# Altium schematic sheet Mosaic-G5.SchDoc
size 420 x 297 mm; CompanyName: Septentrio; Organization: Designed by ANavS; Address1: Septentrio; Address2: Interleuvenlaan 15i; Address3: 3001, Leuven; Address4: Belgium; SheetNumber: 3; SheetTotal: 3
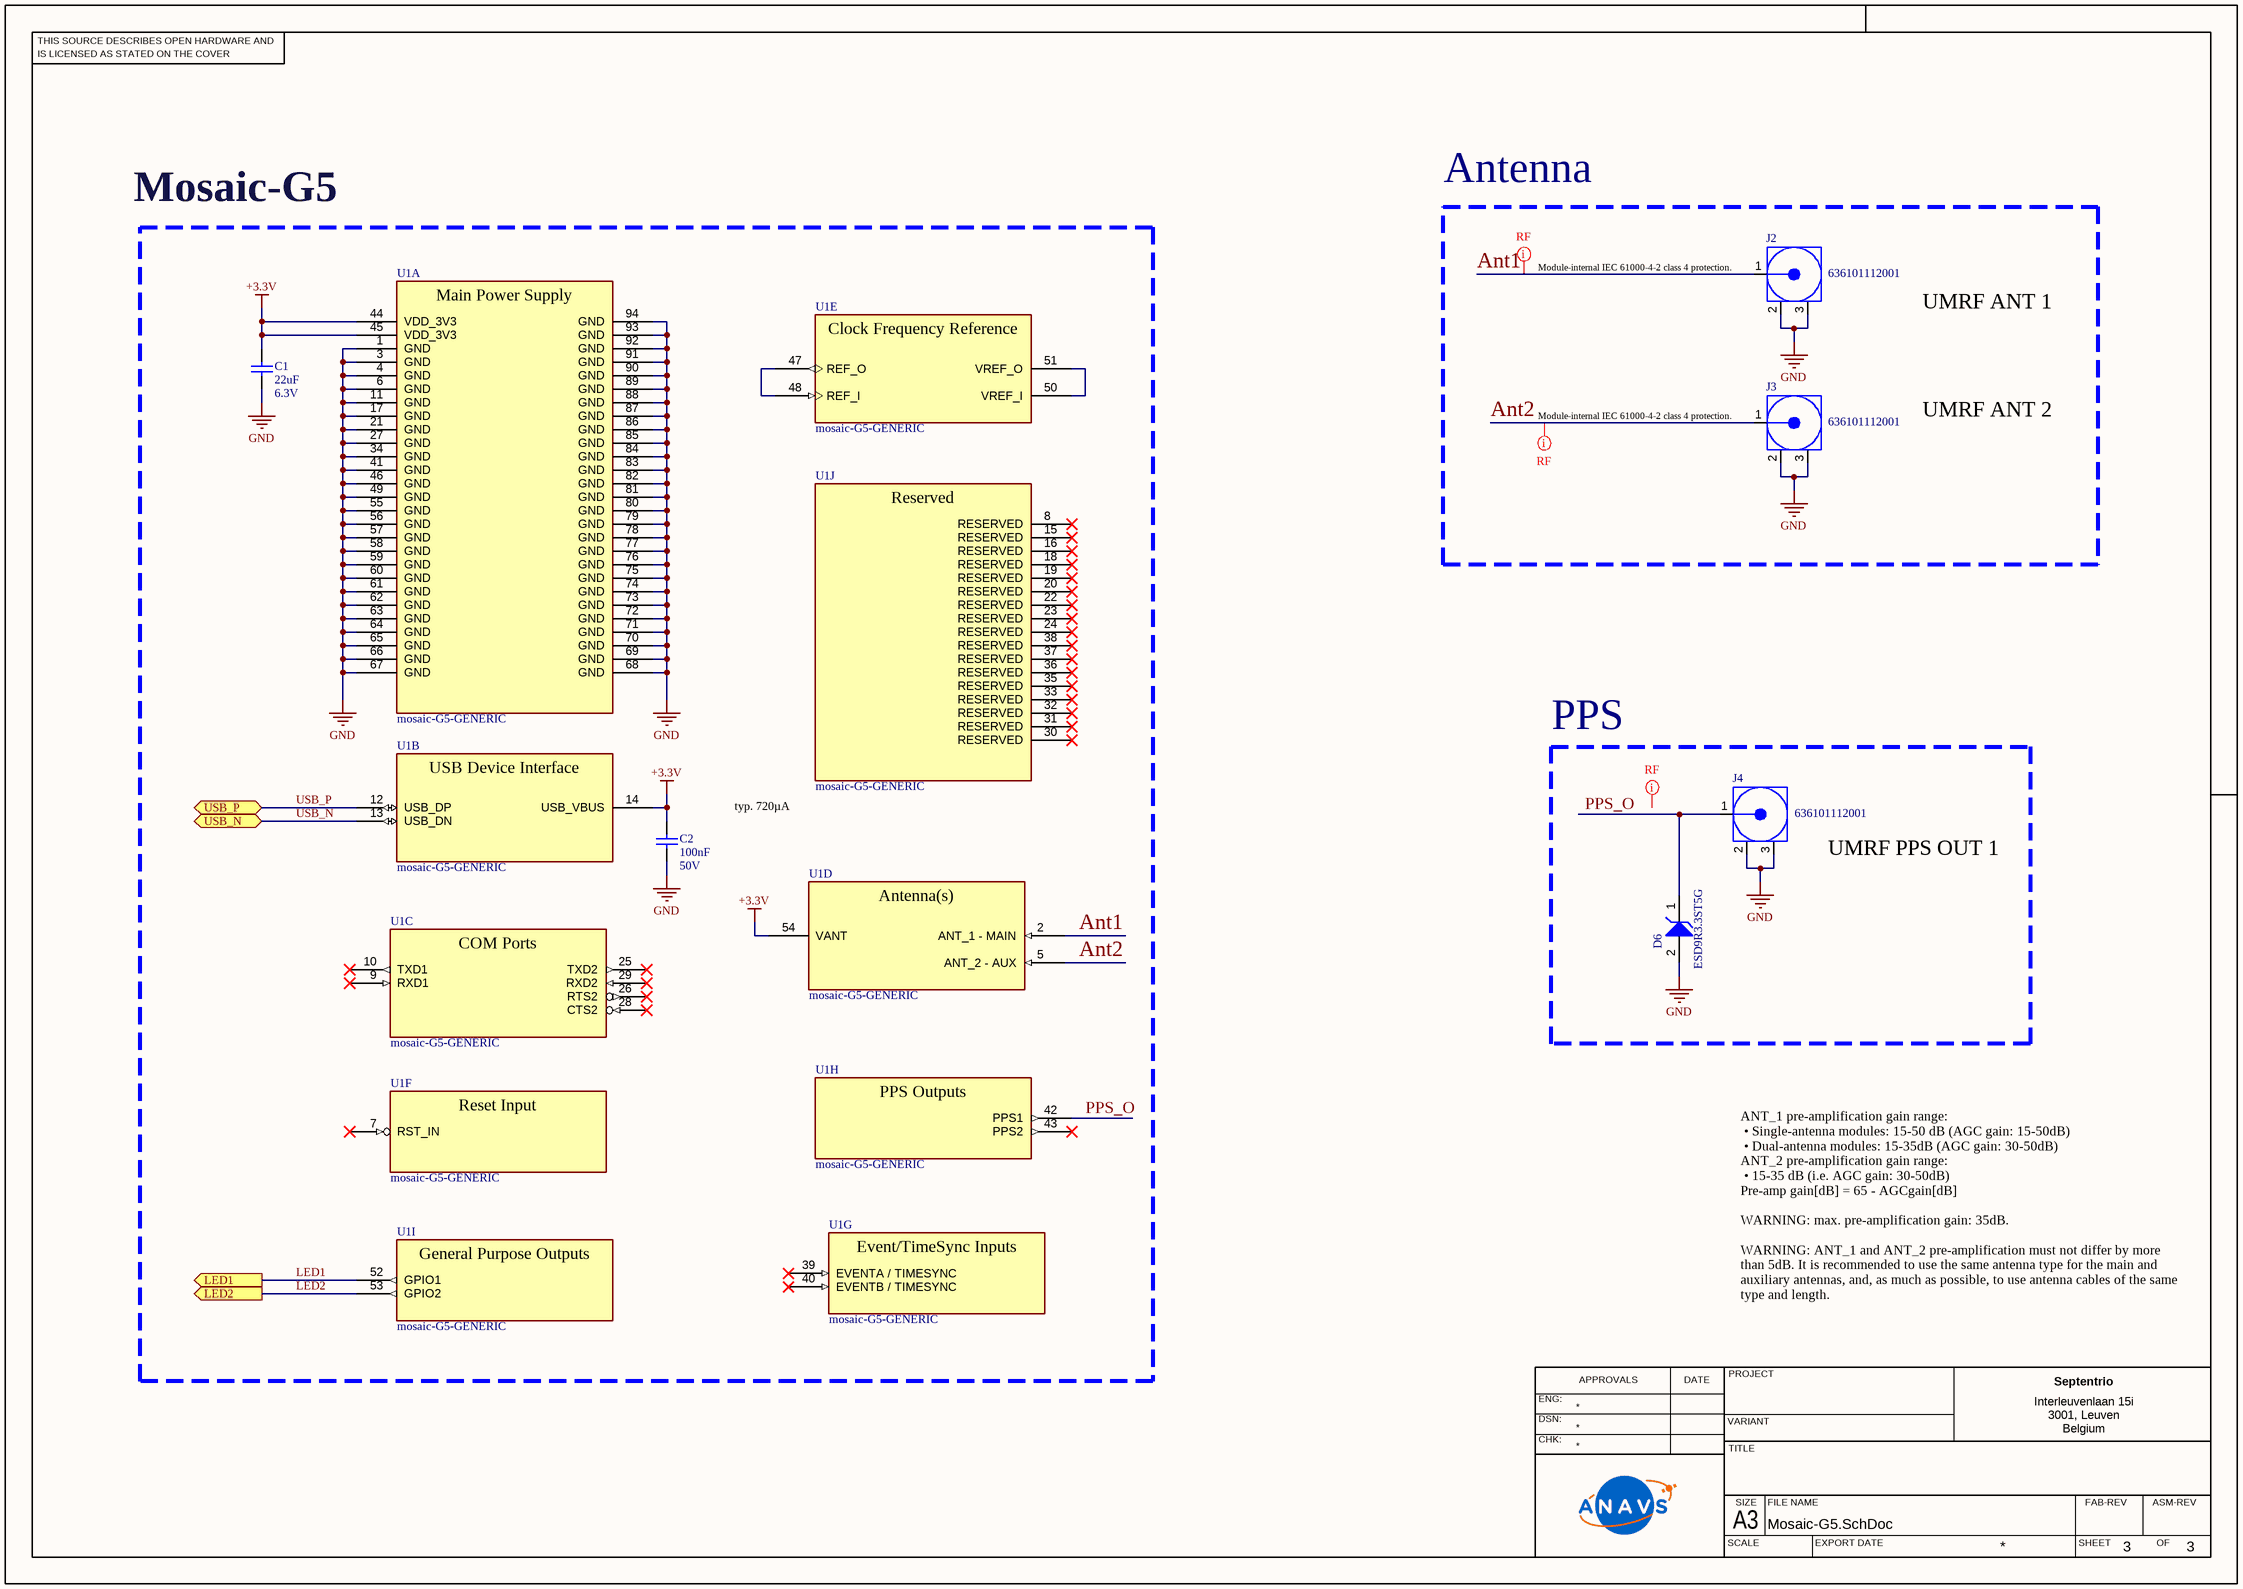
[diagram p0: Mosaic-G5.SchDoc]

## Parts
C1  value 22uF  Voltage: 6.3V  [CAPC1608X100X20ML10]  (hidden comment: C1608X5R0J226M080AC)
C2  Capacitance: 100nF  Voltage: 50V  [CAP0402C]  (hidden comment: GCM155R71H104KE02D)
D6  ESD9R3.3ST5G  [ONSC-SOD-923-2-514AB-01_V]
J2  636101112001  [63610111x001]
J3  636101112001  [63610111x001]
J4  636101112001  [63610111x001]
U1  mosaic-G5-GENERIC  [mosaic-G5-GENERIC-Footprint]  (parts A,B,C,D,E,F,G,H,I,J of 10)

## Blocks framed on the sheet
Antenna: J2 J3
typ. 720µA: C1 C2 U1
PPS: D6 J4

## Ports
LED1 (out), LED2 (out), USB_N (bidir), USB_P (bidir)

## Nets
+3.3V: C1.2 C2.2 U1.14(USB_VBUS) U1.44(VDD_3V3) U1.45(VDD_3V3) U1.54(VANT)
GND: C1.1 C2.1 D6.2(A) J2.2(GND) J2.3(GND) J3.2(GND) J3.3(GND) J4.2(GND) J4.3(GND) U1.1(GND) U1.3(GND) U1.4(GND) U1.6(GND) U1.11(GND) U1.17(GND) U1.21(GND) U1.27(GND) U1.34(GND) U1.41(GND) U1.46(GND) U1.49(GND) U1.55(GND) U1.56(GND) U1.57(GND) U1.58(GND) U1.59(GND) U1.60(GND) U1.61(GND) U1.62(GND) U1.63(GND) U1.64(GND) U1.65(GND) U1.66(GND) U1.67(GND) U1.68(GND) U1.69(GND) U1.70(GND) U1.71(GND) U1.72(GND) U1.73(GND) U1.74(GND) U1.75(GND) U1.76(GND) U1.77(GND) U1.78(GND) U1.79(GND) U1.80(GND) U1.81(GND) U1.82(GND) U1.83(GND) U1.84(GND) U1.85(GND) U1.86(GND) U1.87(GND) U1.88(GND) U1.89(GND) U1.90(GND) U1.91(GND) U1.92(GND) U1.93(GND) U1.94(GND)
Ant1: J2.1(Signal) U1.2(ANT_1_-_MAIN)
Ant2: J3.1(Signal) U1.5(ANT_2_-_AUX)
LED1: U1.52(GPIO1) ; port LED1
LED2: U1.53(GPIO2) ; port LED2
PPS_O: D6.1(K) J4.1(Signal) U1.42(PPS1)
USB_N: U1.13(USB_DN) ; port USB_N
USB_P: U1.12(USB_DP) ; port USB_P
NetU1_47: U1.47(REF_O) U1.48(REF_I)
NetU1_50: U1.50(VREF_I) U1.51(VREF_O)

Not connected (* = marked no-connect by the designer): U1 7(RST_IN)* 8(RESERVED)* 9(RXD1)* 10(TXD1)* 15(RESERVED)* 16(RESERVED)* 18(RESERVED)* 19(RESERVED)* 20(RESERVED)* 22(RESERVED)* 23(RESERVED)* 24(RESERVED)* 25(TXD2)* 26(RTS2)* 28(CTS2)* 29(RXD2)* 30(RESERVED)* 31(RESERVED)* 32(RESERVED)* 33(RESERVED)* 35(RESERVED)* 36(RESERVED)* 37(RESERVED)* 38(RESERVED)* 39(EVENTA_/_TIMESYNC)* 40(EVENTB_/_TIMESYNC)* 43(PPS2)*

## Layout directives
net class RF: (no net found under the mark), Ant1, Ant2

## Notes on the sheet
- Mosaic-G5
- (near J2) Module-internal IEC 61000-4-2 class 4 protection.
- UMRF ANT 1
- (near J3) Module-internal IEC 61000-4-2 class 4 protection.
- UMRF ANT 2
- UMRF PPS OUT 1
- ANT_1 pre-amplification gain range:
  • Single-antenna modules: 15-50 dB (AGC gain: 15-50dB)
  • Dual-antenna modules: 15-35dB (AGC gain: 30-50dB)
  ANT_2 pre-amplification gain range:
  • 15-35 dB (i.e. AGC gain: 30-50dB)
  Pre-amp gain[dB] = 65 - AGCgain[dB]
  WARNING: max. pre-amplification gain: 35dB.
  WARNING: ANT_1 and ANT_2 pre-amplification must not differ by more than 5dB. It is recommended to use the same antenna type for the main and auxiliary antennas, and, as much as possible, to use antenna cables of the same type and length.
- THIS SOURCE DESCRIBES OPEN HARDWARE AND
- IS LICENSED AS STATED ON THE COVER
- ENG:
- APPROVALS
- DATE
- PROJECT
- DSN:
- CHK:
- VARIANT
- TITLE
- SCALE
- A3
- SIZE
- FILE NAME
- EXPORT DATE
- SHEET
- FAB-REV
- ASM-REV
- OF
- (in symbol CMP-00025-00009-1, part A) Main Power Supply
- (in symbol CMP-00025-00009-1, part B) USB Device Interface
- (in symbol CMP-00025-00009-1, part C) COM Ports
- (in symbol CMP-00025-00009-1, part D) Antenna(s)
- (in symbol CMP-00025-00009-1, part E) Clock Frequency Reference
- (in symbol CMP-00025-00009-1, part F) Reset Input
- (in symbol CMP-00025-00009-1, part G) Event/TimeSync Inputs
- (in symbol CMP-00025-00009-1, part H) PPS Outputs
- (in symbol CMP-00025-00009-1, part I) General Purpose Outputs
- (in symbol CMP-00025-00009-1, part J) Reserved

## Library data of the parts
C1 = CMP-001-00146-1: MLCC, 22 uF, 0603, 6.3 V, 20%, X5R; Dielectric Material: Ceramic; Case Code (Metric): 1608; Max Operating Temperature: 85°C; RoHS Compliant: Yes; Mounting Technology: Surface Mount; Width: 0.031inch; Lead Free: Lead Free; Length: 1.6mm; Height: 0.8mm; Case Code (Imperial): 0603; Series: C; Depth: 0.8mm; Weight: 7.1E-05oz; Package Quantity: 1; Voltage Rating: 6.3V; Termination: SMD/SMT; Packaging: Tape and Reel; Voltage Rating (DC): 6.3V; Case/Package: 0603; Thickness: 0.039inch; Reach SVHC Compliant: Unknown; Dielectric: X5R; Min Operating Temperature: -55°C; Tolerance: 20%
C2 = CMP-001-00114-5: MLCC, 100 nF, 0402, 50 V, 10%, X7R; Weight: 0.000212oz; Case/Package: 0402; RoHS Compliant: Yes; Ratings: AEC-Q200; Max Operating Temperature: 125°C; Voltage Rating: 50V; Case Code (Metric): 1005; Width: 0.02inch; Length: 0.039inch; Height: 0.5mm; Series: GCM; Reach SVHC Compliant: Yes; Case Code (Imperial): 0402; Dielectric: X7R; Packaging: Tape and Reel; Thickness: 0.022inch; Min Operating Temperature: -55°C; Lead Free: Lead Free; Package Quantity: 10000; Tolerance: 10%; Mount: Surface Mount; Voltage Rating (DC): 50V; Termination: SMD/SMT
D6 = CMP-004-00061-1: ESD9R3.3S Series 4.8 V 0.5 pF Uni-Directional ESD Protection Diode - SOD-923; Breakdown Voltage: 4.8V; Clamping Voltage-Max: 7.8V; Number of Unidirectional Channels: 1; Polarity: Unidirectional; Operating Supply Voltage: 3.3V; Value: 0.9pF; Peak Pulse Current: 1A; ESD Protection: Yes; Max Reverse Leakage Current: 1nA; Max Power Dissipation: 150mW; Power Line Protection: No; Test Current: 1mA; Diode Type: ZENER; Pins: 2; Reach SVHC Compliant: No; Min Operating Temperature: -55°C; Depth: 0.6mm; Height: 0.4mm; Lead Free: Lead Free; Radiation Hardening: No; Number of Elements: 1; Case/Package: SOD-923-2; Number of Channels: 1; Min Breakdown Voltage: 4.8V; Halogen Free: Halogen Free; Width: 0.65mm; Reverse Standoff Voltage: 3.3V; Packaging: Tape and Reel; Package Quantity: 8000; Working Voltage: 3.3V; Max Breakdown Voltage: 4.8V; Length: 0.8mm; Direction: Unidirectional; Max Surge Current: 1A; Termination: SMD/SMT; Max Operating Temperature: 125°C; Leakage Current: 1nA; Peak Pulse Power: 150mW; Clamping Voltage: 7.8V; Series: -; Number of Lines: 1
J2-J4 = CMP-002-00136-3: Rf Conn, Umrf, Jack, 50 Ohm, Pcb Rohs Compliant: Yes; Impedance: 50R; Insulation Resistance: 500MR; Max Operating Temperature: 90°C; Packaging: Tape and Reel; Min Operating Temperature: -40°C
U1 = CMP-00025-00009-1: mosaic-G5 GNSS Module - Low-power multi-band multi-constellation GNSS receiver.; Manufacturer: septentrio; Max RF input power at ANT_1: 20dBm; Max Power Consumption: 785mW; Peak Current Consumption: 500mA; Max RF input power at ANT_2: 10dBm; Feature 1: dual antenna; Feature 2: 10 MHz in; Min Storage Temperature: -55°C; Weight: 2.2g; Max Operating Temperature: +85°C; Min Operating Temperature: -40°C; Max Storage Temperature: +85°C